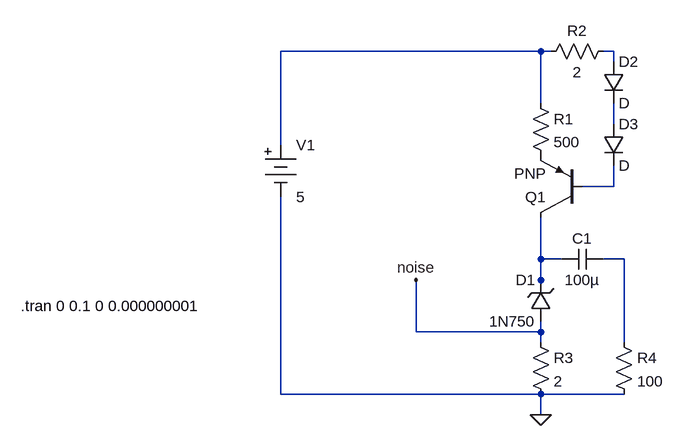
[diagram p0: schematic Classic_noise_gen.asc]
Classic_noise_gen.asc, the LTspice schematic file:
Version 4
SHEET 1 880 680
WIRE 448 0 48 0
WIRE 464 0 448 0
WIRE 560 0 544 0
WIRE 560 16 560 0
WIRE 448 80 448 0
WIRE 560 112 560 80
WIRE 48 144 48 0
WIRE 560 208 560 176
WIRE 560 208 512 208
WIRE 448 320 448 256
WIRE 480 320 448 320
WIRE 576 320 544 320
WIRE 448 352 448 320
WIRE 448 368 448 352
WIRE 256 432 256 352
WIRE 448 432 448 416
WIRE 448 432 256 432
WIRE 448 448 448 432
WIRE 576 448 576 320
WIRE 48 528 48 224
WIRE 448 528 48 528
WIRE 576 528 448 528
WIRE 448 560 448 528
FLAG 256 352 noise
FLAG 448 560 0
SYMBOL Misc\\battery 48 128 R0
WINDOW 123 0 0 Left 2
WINDOW 39 0 0 Left 2
SYMATTR InstName V1
SYMATTR Value 5
SYMBOL zener 464 416 R180
WINDOW 0 24 64 Left 2
WINDOW 3 24 0 Left 2
SYMATTR InstName D1
SYMATTR Value 1N750
SYMBOL cap 544 304 R90
WINDOW 0 0 32 VBottom 2
WINDOW 3 32 32 VTop 2
SYMATTR InstName C1
SYMATTR Value 100µ
SYMBOL res 432 64 R0
SYMATTR InstName R1
SYMATTR Value 500
SYMBOL pnp 512 256 R180
SYMATTR InstName Q1
SYMBOL diode 544 16 R0
SYMATTR InstName D2
SYMBOL diode 544 112 R0
SYMATTR InstName D3
SYMBOL res 560 -16 R90
WINDOW 0 0 56 VBottom 2
WINDOW 3 32 56 VTop 2
SYMATTR InstName R2
SYMATTR Value 2
SYMBOL res 432 432 R0
SYMATTR InstName R3
SYMATTR Value 2
SYMBOL res 560 432 R0
SYMATTR InstName R4
SYMATTR Value 100
TEXT -352 392 Left 2 !.tran 0 0.1 0 0.000000001

The netlist it stands for:
* Classic_noise_gen.asc
V1 N001 0 5
D1 noise N005 1N750
C1 N006 N005 100µ
R1 N001 P001 500
Q1 N005 N004 P001 0 PNP
D2 N002 N003 D
D3 N003 N004 D
R2 N002 N001 2
R3 noise 0 2
R4 N006 0 100
.model D D
.lib standard.dio
.model NPN NPN
.model PNP PNP
.lib standard.bjt
.tran 0 0.1 0 0.000000001
.backanno
.end